# Altium project tc571prog.PrjPcb
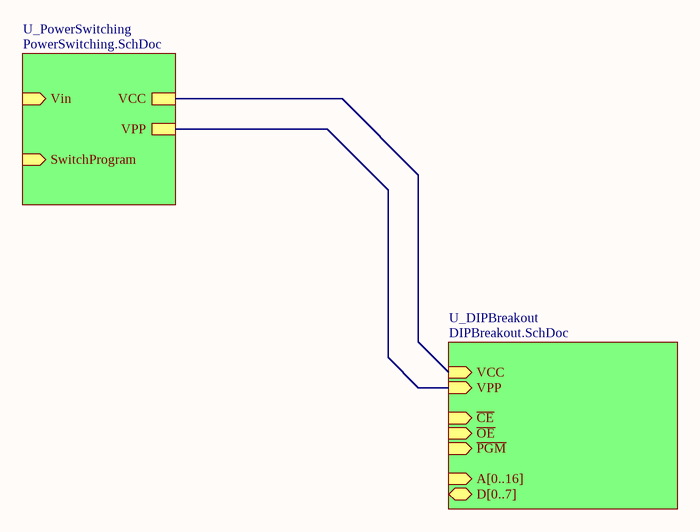
[diagram p0: TopLevel.SchDoc]
3 sheets, 3 parts. Net scope: hierarchical (ports join the sheet entries above them; power ports are global).
Board file: Board_Single.PcbDoc
Sheets:
  TopLevel.SchDoc
  Schematic1.SchDoc
  Mechanical.SchDoc

## Sheet TopLevel.SchDoc
size B; SheetNumber: 1; SheetTotal: 4

### Sub-sheets
U_DIPBreakout = DIPBreakout.SchDoc (file not in this document): A[0..16] (in), D[0..7] (bidir), VCC (in), VPP (in), ~{PGM} (in), ~{OE} (in), ~{CE} (in)
U_PowerSwitching = PowerSwitching.SchDoc (file not in this document): Vin (in), SwitchProgram (in), VCC, VPP

### Nets
(unnamed): sheet U_PowerSwitching/VCC, sheet U_DIPBreakout/VCC
(unnamed): sheet U_PowerSwitching/VPP, sheet U_DIPBreakout/VPP

## Sheet Schematic1.SchDoc
size A; SheetNumber: 2; SheetTotal: 2

## Sheet Mechanical.SchDoc
size A; SheetNumber: 3; SheetTotal: 3
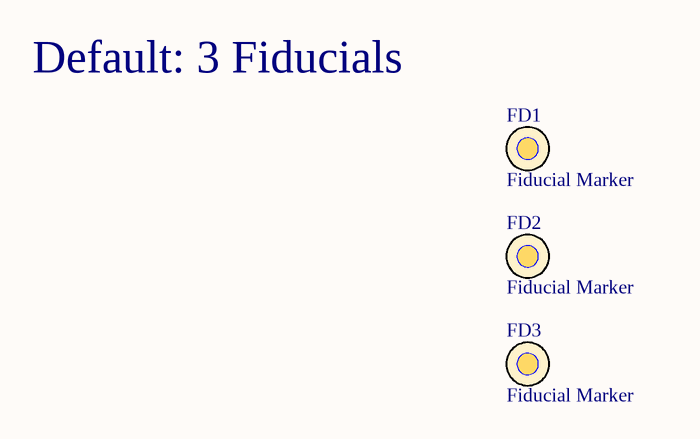
[diagram p1: Mechanical.SchDoc]

### Parts
FD1  Fiducial Marker  [FIDUCIAL]
FD2  Fiducial Marker  [FIDUCIAL]
FD3  Fiducial Marker  [FIDUCIAL]

### Notes on the sheet
- (near FD1) Default: 3 Fiducials

### Library data of the parts
FD1-FD3 = Fiducial